# EAGLE design Main ESP32 (EAGLE 9.6.2)
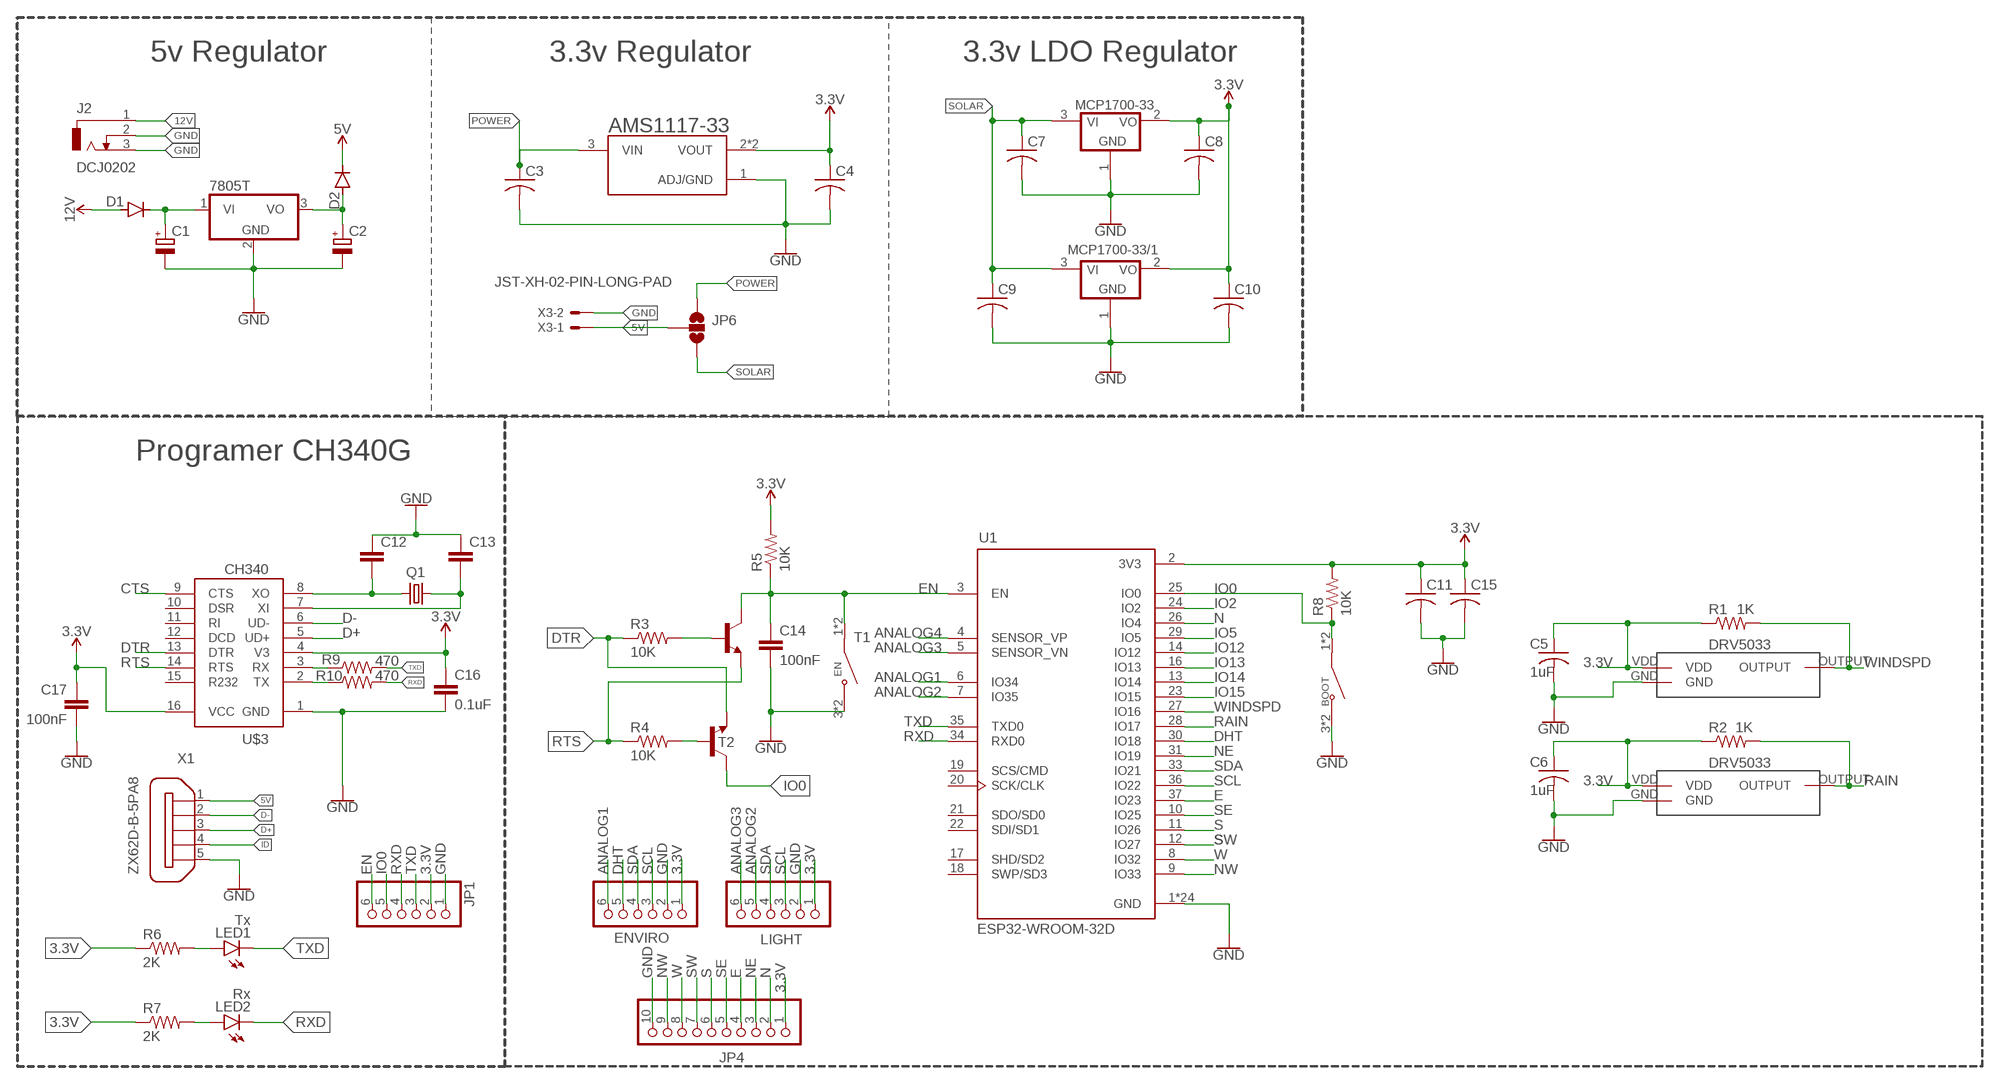
[diagram p0: schematic, sheet 1]

## Parts
AMS1117-33  AMS1117-5.0  [SOT229P700X180-4N]
BOOT  2-1437565-9  [SW_2-1437565-9]
C1  CPOL-EUE2.5-5  [E2,5-5]
C2  CPOL-EUE2.5-5  [E2,5-5]
C3  C-USC1206K  [C1206K]
C4  C-USC1206K  [C1206K]
C5  1uF  C-USC1206K  [C1206K]
C6  1uF  C-USC1206K  [C1206K]
C7  C-USC1206K  [C1206K]
C8  C-USC1206K  [C1206K]
C9  C-USC1206K  [C1206K]
C10  C-USC1206K  [C1206K]
C11  C-USC1206K  [C1206K]
C12  C-EUC1206K  [C1206K]
C13  C-EUC1206K  [C1206K]
C14  100nF  C-EUC1206K  [C1206K]
C15  C-USC1206K  [C1206K]
C16  0.1uF  C-EUC1206K  [C1206K]
C17  100nF  C-EUC1206K  [C1206K]
D1  1N4148DO35-10  [DO35-10]
D2  1N4148DO35-10  [DO35-10]
EN  2-1437565-9  [SW_2-1437565-9]
ENVIRO  PINHD-1X6/90  [1X06/90]
IC1  7805T  [TO220H]
J2  DCJ0202  [DCJ0202]
JP1  PINHD-1X6  [1X06]
JP4  PINHD-1X10/90  [1X10/90]
JP6  JUMPER-SMT_3_NO_SILK  [SMT-JUMPER_3_NO_SILK]
LED1  Tx  LEDCHIPLED_1206  [CHIPLED_1206]
LED2  Rx  LEDCHIPLED_1206  [CHIPLED_1206]
LIGHT  Light  PINHD-1X6/90  [1X06/90]
MCP1700-33  MCP1703-3302E/CB  [SOT23A_MICROCHIP_CB]
MCP1700-33/1  MCP1703-3302E/CB  [SOT23A_MICROCHIP_CB]
Q1  CRYSTALHC49S  [HC49/S]
R1  1K  R-US_R1206  [R1206]
R2  1K  R-US_R1206  [R1206]
R3  10K  R-US_R1206  [R1206]
R4  10K  R-US_R1206  [R1206]
R5  10K  R-US_R1206  [R1206]
R6  2K  R-US_R1206  [R1206]
R7  2K  R-US_R1206  [R1206]
R8  10K  R-US_R1206  [R1206]
R9  470  R-US_R1206  [R1206]
R10  470  R-US_R1206  [R1206]
T1  BC847  BC850  [SOT23]
T2  BC847  BC850  [SOT23]
U1  ESP32-WROOM-32D  [MODULE_ESP32-WROOM-32D]
U$1  DRV5033  [DRV5033]
U$2  DRV5033  [DRV5033]
U$3  CH340  [SOIC16]
X1  ZX62D-B-5PA8  [ZX62D-B-5PA8]
X3  JST-XH-02-PIN-LONG-PAD  [JST-XH-02-PACKAGE-LONG-PAD]

## Nets
3.3V: AMS1117-33.2(VOUT) AMS1117-33.4(VOUT) C4.1 C5.1 C6.1 C8.1 C10.1 C11.1 C15.1 C16.1 C17.1 ENVIRO.1 JP1.2 JP4.1 LIGHT.1 MCP1700-33.2(VO) MCP1700-33/1.2(VO) R1.1 R2.1 R5.2 R6.1 R7.1 R8.2 U1.2(3V3) U$1.VDD U$2.VDD U$3.4(V3) U$3.16(VCC)
5V: D2.C JP6.2 X1.1 X3.1
12V: D1.A J2.1
ANALOG1: ENVIRO.6 U1.6(IO34)
ANALOG2: LIGHT.5 U1.7(IO35)
ANALOG3: LIGHT.6 U1.5(SENSOR_VN)
ANALOG4: U1.4(SENSOR_VP)
CTS: U$3.9(CTS)
D+: U$3.5(UD+) X1.3
D-: U$3.6(UD-) X1.2
DHT: ENVIRO.5 U1.30(IO18)
DTR: R3.1 T2.2(E) U$3.13(DTR)
E: JP4.4 U1.37(IO23)
EN: C14.1 EN.1(COM) EN.2(COM) JP1.6 R5.1 T1.3(C) U1.3(EN)
GND: AMS1117-33.1(ADJ/GND) BOOT.3(NO) BOOT.4(NO) C1.- C2.- C3.2 C4.2 C5.2 C6.2 C7.2 C8.2 C9.2 C10.2 C11.2 C12.1 C13.1 C14.2 C15.2 C16.2 C17.2 EN.3(NO) EN.4(NO) ENVIRO.2 IC1.2(GND) J2.2 J2.3 JP1.1 JP4.10 LIGHT.2 MCP1700-33.1(GND) MCP1700-33/1.1(GND) U1.1(GND) U1.15(GND) U1.38(GND) U1.39_1(GND) U1.39_2(GND) U1.39_3(GND) U1.39_4(GND) U1.39_5(GND) U1.39_6(GND) U1.39_7(GND) U1.39_8(GND) U1.39_9(GND) U1.39_10(GND) U1.39_11(GND) U1.39_12(GND) U1.39_13(GND) U1.39_14(GND) U1.39_15(GND) U1.39_16(GND) U1.39_17(GND) U1.39_18(GND) U1.39_19(GND) U1.39_20(GND) U1.39_21(GND) U$1.GND U$2.GND U$3.1(GND) X1.5 X3.2
ID: X1.4
IO0: BOOT.1(COM) BOOT.2(COM) JP1.5 R8.1 T2.3(C) U1.25(IO0)
IO2: U1.24(IO2)
IO5: U1.29(IO5)
IO12: U1.14(IO12)
IO13: U1.16(IO13)
IO14: U1.13(IO14)
IO15: U1.23(IO15)
N: JP4.2 U1.26(IO4)
N$1: C1.+ D1.C IC1.1(VI)
N$2: C2.+ D2.A IC1.3(VO)
N$3: C12.2 Q1.2 U$3.8(XO)
N$4: C13.2 Q1.1 U$3.7(XI)
N$5: LED1.A R6.2
N$6: LED2.A R7.2
N$7: R9.1 U$3.3(RX)
N$8: R3.2 T1.1(B)
N$9: R10.1 U$3.2(TX)
N$10: R4.2 T2.1(B)
NE: JP4.3 U1.31(IO19)
NW: JP4.9 U1.9(IO33)
POWER: AMS1117-33.3(VIN) C3.1 JP6.1
RAIN: R2.2 U1.28(IO17) U$1.OUTPUT
RTS: R4.1 T1.2(E) U$3.14(RTS)
RXD: JP1.4 LED2.C R10.2 U1.34(RXD0)
S: JP4.6 U1.11(IO26)
SCL: ENVIRO.3 LIGHT.3 U1.36(IO22)
SDA: ENVIRO.4 LIGHT.4 U1.33(IO21)
SE: JP4.5 U1.10(IO25)
SOLAR: C7.1 C9.1 JP6.3 MCP1700-33.3(VI) MCP1700-33/1.3(VI)
SW: JP4.7 U1.12(IO27)
TXD: JP1.3 LED1.C R9.2 U1.35(TXD0)
W: JP4.8 U1.8(IO32)
WINDSPD: R1.2 U1.27(IO16) U$2.OUTPUT
Unconnected: U1.17(SHD/SD2) U1.18(SWP/SD3) U1.19(SCS/CMD) U1.20(SCK/CLK) U1.21(SDO/SD0) U1.22(SDI/SD1) U$3.10(DSR) U$3.11(RI) U$3.12(DCD) U$3.15(R232) X1.S1 X1.S2 X1.S3 X1.S4

## Notes on the sheet
- 5v Regulator | 3.3v Regulator | 3.3v LDO Regulator
- Programer CH340G

## Library data of the parts
AMS1117-33 = AMS1117-5.0:AMS1117-5.0: Sot223/Pkg 1-Amp 5-Volt Low Drop Out Voltage Regulatator Check prices <https://pricing.snapeda.com/parts/AMS1117-5.0/Advanced%20Monolithic%20Systems/view-part?ref=eda>; AVAILABILITY: No availability data; DESCRIPTION: Sot223/Pkg 1-Amp 5-Volt Low Drop Out Voltage Regulatator; MF: Advanced Monolithic Systems; MP: AMS1117-5.0; PACKAGE: None; PRICE: None
BOOT EN = 2-1437565-9:2-1437565-9: Check prices <https://pricing.snapeda.com/parts/2-1437565-9/TE%20Connectivity/view-part?ref=eda>; AVAILABILITY: In Stock; COMMENT: 2-1437565-9; DESCRIPTION: Tactile Switch SPST-NO Top Actuated Surface Mount; MF: TE Connectivity; MP: 2-1437565-9; PACKAGE: SMD-6 Omron Electronics; PRICE: None
C1 C2 = rcl:CPOL-EU: POLARIZED CAPACITOR, European symbol; SPICEPREFIX: C
C3-C11 C15 = rcl:C-US: CAPACITOR, American symbol; SPICEPREFIX: C
C12-C14 C16 C17 = rcl:C-EU: CAPACITOR, European symbol; SPICEPREFIX: C
D1 D2 = diode:1N4148: DIODE high speed (Philips)
ENVIRO JP1 LIGHT = pinhead:PINHD-1X6: PIN HEADER
IC1 = linear:78*: Positive VOLTAGE REGULATOR Source: http://cache.national.com/ds/LM/LM78L05.pdf http://www.fairchildsemi.com/ds/LM/LM7805.pdf
J2 = con-jack:DCJ0202: DC POWER JACK Source: DCJ0202.pdf; OC_FARNELL: unknown; OC_NEWARK: unknown
JP4 = pinhead:PINHD-1X10: PIN HEADER
JP6 = SparkFun-Jumpers:JUMPER-SMT_3_NO: Normally open jumper This jumper has three pads in close proximity to each other. Apply solder to close the connection(s).
LED1 LED2 = led:LED: LED OSRAM: - CHIPLED LG R971, LG N971, LY N971, LG Q971, LY Q971, LO R971, LY R971 LH N974, LH R974 LS Q976, LO Q976, LY Q976 LO Q996 - Hyper CHIPLED LW Q18S LB Q993, LB Q99A, LB R99A - SideLED LS A670, LO A670, LY A670, LG A670, LP A670 LB A673, LV A673, LT A673, LW A673 LH A674 LY A675 LS A676, LA A676, LO A676, LY A676, LW A676 LS A679, LY A679, LG A679 - Hyper Micro SIDELED® LS Y876, LA Y876, LO Y876, LY Y876 LT Y87S - SmartLED LW L88C, LW L88S LB L89C, LB L89S, LG L890 LS L89K, LO L89K, LY L89K LS L896, LA L896, LO L896, LY L896 - TOPLED LS T670, LO T670, LY T670, LG T670, LP T670 LSG T670, LSP T670, LSY T670, LOP T670, LYG T670 LG T671, LOG T671, LSG T671 LB T673, LV T673, LT T673, LW T673 LH T674 LS T676, LA T676, LO T676, LY T676, LB T676, LH T676, LSB T676, LW T676 LB T67C, LV T67C, LT T67C, LS T67K, LO T67K, LY T67K, LW E67C LS E67B, LA E67B, LO E67B, LY E67B, LB E67C, LV E67C, LT E67C LW T67C LS T679, LY T679, LG T679 LS T770, LO T770, LY T770, LG T770, LP T770 LB T773, LV T773, LT T773, LW T773 LH T774 LS E675, LA E675, LY E675, LS T675 LS T776, LA T776, LO T776, LY T776, LB T776 LHGB T686 LT T68C, LB T68C - Hyper Mini TOPLED® LB M676 - Mini TOPLED Santana® LG M470 LS M47K, LO M47K, LY M47K Source: http://www.osram.convergy.de LUXEON: - LUMILED® LXK2-PW12-R00, LXK2-PW12-S00, LXK2-PW14-U00, LXK2-PW14-V00 LXK2-PM12-R00, LXK2-PM12-S00, LXK2-PM14-U00 LXK2-PE12-Q00, LXK2-PE12-R00, LXK2-PE12-S00, LXK2-PE14-T00, LXK2-PE14-U00 LXK2-PB12-K00, LXK2-PB12-L00, LXK2-PB12-M00, LXK2-PB14-N00, LXK2-PB14-P00, LXK2-PB14-Q00 LXK2-PR12-L00, LXK2-PR12-M00, LXK2-PR14-Q00, LXK2-PR14-R00 LXK2-PD12-Q00, LXK2-PD12-R00, LXK2-PD12-S00 LXK2-PH12-R00, LXK2-PH12-S00 LXK2-PL12-P00, LXK2-PL12-Q00, LXK2-PL12-R00 Source: www.luxeon.com KINGBRIGHT: KA-3528ASYC Source: www.kingbright.com
MCP1700-33 MCP1700-33/1 = MCP1700:MCP1703*02E/CB: MCP1703[A] Series of Voltage Regulators – SOT23A (Microchip CB) (1.2 … 5.0)V, LDO, 16 V Input, 100/150/200/250 mA, Low Quiescent Current Source: http://ww1.microchip.com/downloads/en/DeviceDoc/22049f.pdf http://ww1.microchip.com/downloads/en/DeviceDoc/25122A.pdf Packages: SOT23, Microchip package identifier "CB" (dimensions and recommended land patterns acc. to Microchip) Technologies: MCP1703[A]T-xx02E/CB T : Tape and Reel xx: Output Voltage * 1000 mV; 12|15|18|25|28|30|33|40|50 0 : Extra Feature Code (fixed) 2 : Output volt. Tol.: ±2% (standard) E : Temperature range (−40…+125)°C CB: Package: SOT23A Author: Dipl.-Ing. FH Rainer Bayer HHN Hochschule Heilbronn, rainer.bayer@hs-heilbronn.de Ingenieurbüro ing-rb, mail@ing-rb.de
Q1 = adafruit:CRYSTAL: CRYSTAL; OC_FARNELL: 1667008; OC_NEWARK: unknown
R1-R10 = rcl:R-US_: RESISTOR, American symbol; SPICEPREFIX: R
T1 T2 = transistor:BC850: NPN TRANSISTOR
U1 = ESP32-WROOM-32D:ESP32-WROOM-32D: Bluetooth, WiFi 802.11b/g/n, Bluetooth v4.2 + EDR, Class 1, 2 and 3 Transceiver Module 2.4GHz ~ 2.5GHz Integrated, Trace Surface Mount Check prices <https://pricing.snapeda.com/parts/ESP32-WROOM-32D/Espressif%20Systems/view-part?ref=eda>; AVAILABILITY: In Stock; DESCRIPTION: Bluetooth, WiFi 802.11b/g/n, Bluetooth v4.2 +EDR, Class 1, 2 and 3 Transceiver Module 2.4GHz ~ 2.5GHz Integrated; MF: Espressif Systems; MP: ESP32-WROOM-32D; PACKAGE: Module Espressif Systems; PRICE: None; PURCHASE-URL: https://pricing.snapeda.com/search/part/ESP32-WROOM-32D/?ref=eda
U$1 U$2 = DRV5033 hall Sensor :DRV5033
U$3 = CH340:CH340: Check prices <https://pricing.snapeda.com/parts/CH340/DFRobot/view-part?ref=eda>; AVAILABILITY: In Stock; DESCRIPTION: CH340G USB 2.0 to UART (RS232/RS422/RS485) Bridge Interface Evaluation Board; MF: DFRobot; MP: CH340; PACKAGE: None; PRICE: None; PURCHASE-URL: https://pricing.snapeda.com/search/part/CH340/?ref=eda
X1 = zx62d-b-5pa8-oshpark_10:ZX62D-B-5PA8: Micro USB Type B Connector - Standard, Shell Through Hole Source: http://www.hirose.co.jp/cataloge_hp/ed_ZX_20140804.pdf; MF: Hirose; MPN: ZX62D-B-5PA8; OC_FARNELL: 2300438; OC_NEWARK: 69W0712
X3 = Rembrandt Electronics - JST XH Connectors v1-0:JST-XH-02-PIN: JST XH Connector 2 Pin Wire to board connector. Pitch: 2,54 mm, (0.100") Number of pins: 2 Created by Rembrandt Electronics www.rembrandtelectronics.com

## Board
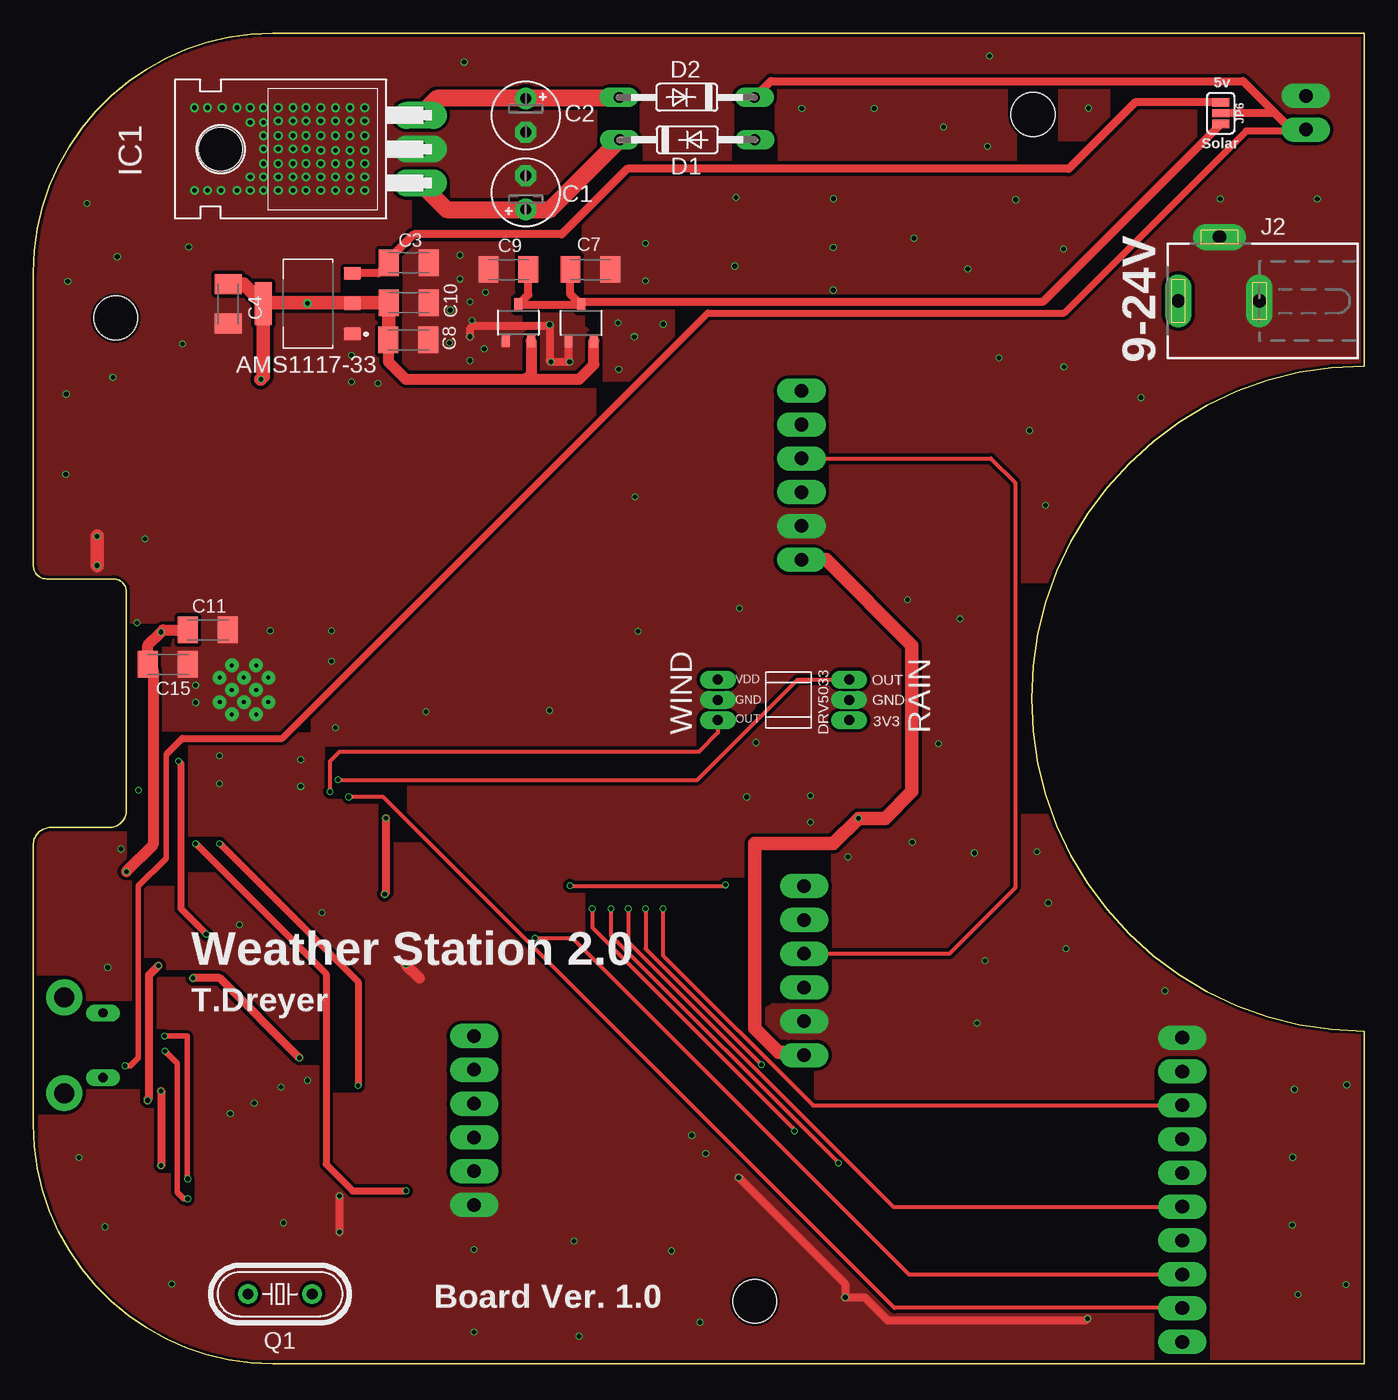
[diagram p1: board, top side]
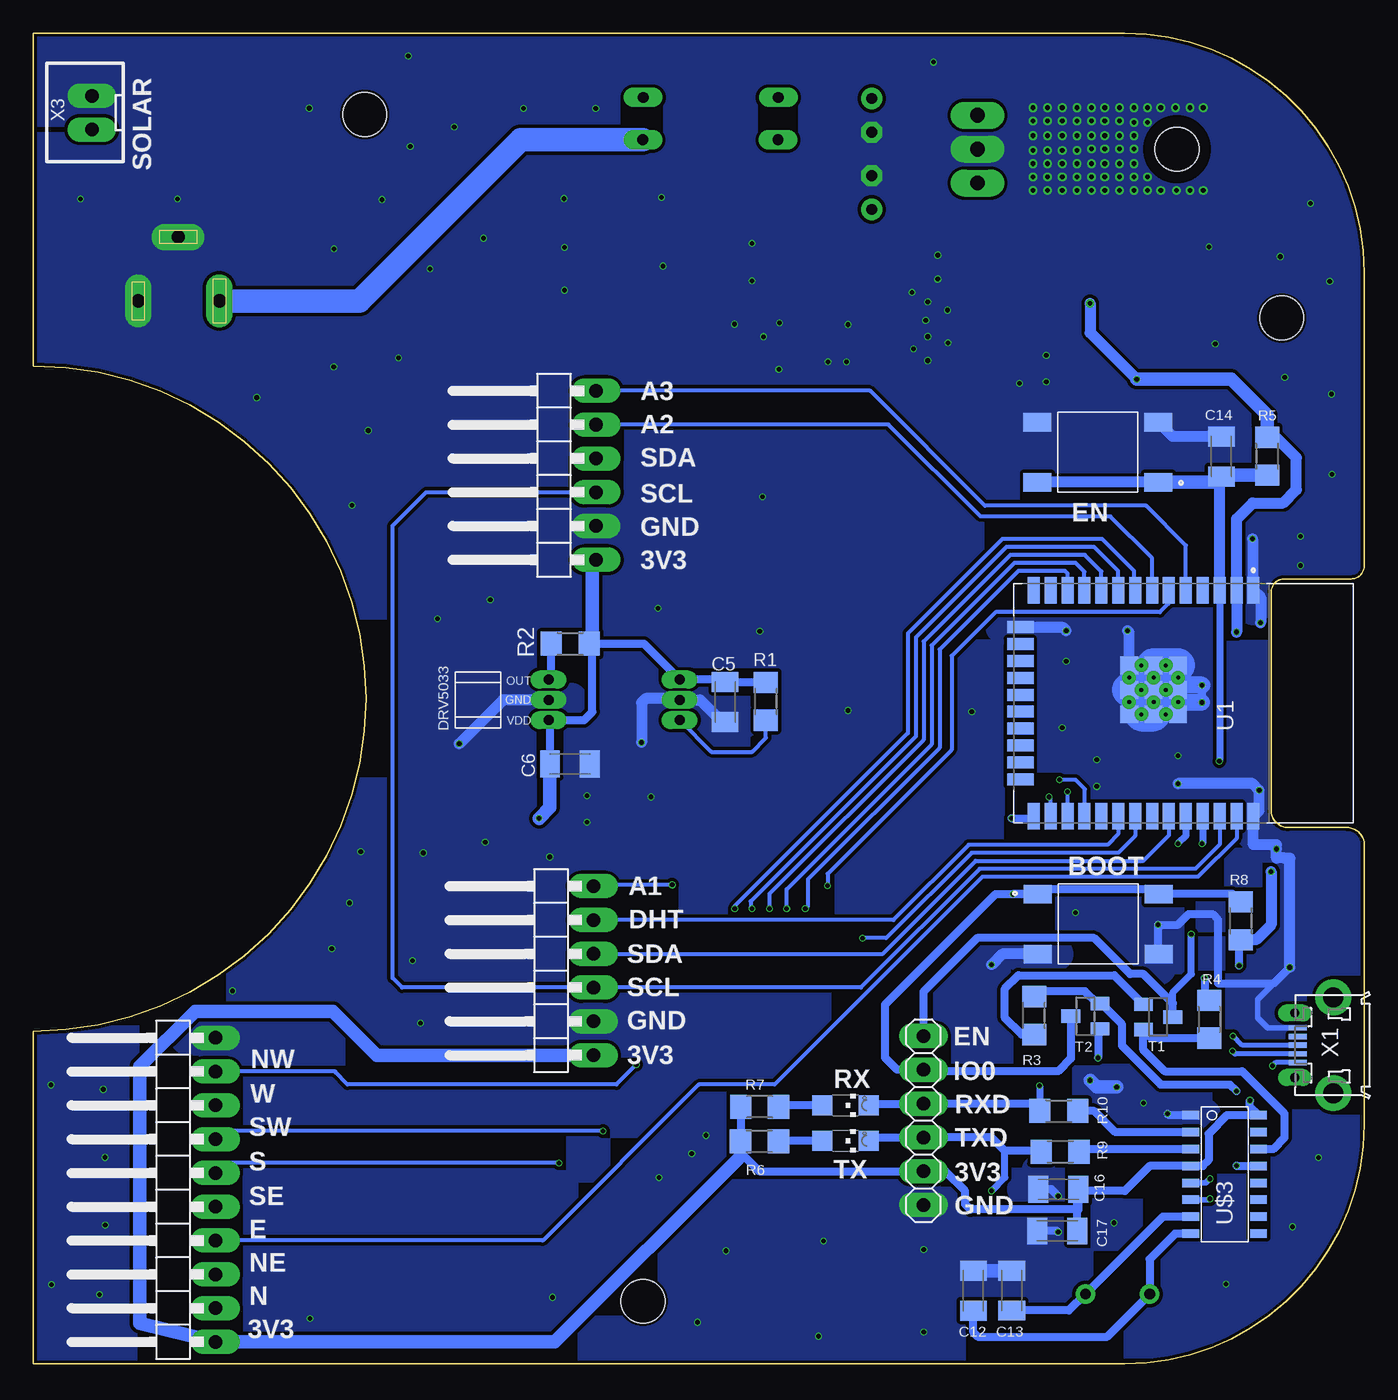
[diagram p2: board, bottom side, seen from below]

Size 100 x 100 mm. Coordinates in mm from the lower left corner, seen from the top.
Outline: 0,18 0,39 arc-90 1.3,40.3 5.7,40.3 arc90 7,41.6 7,58 arc90 6,59 1,59 arc-90 0,60 0,82 arc-90 18,100 100,100 100,75 arc180 100,25 100,0 18,0 arc-90 0,18
Copper layers (1*16): Top 0.035mm / dielectric 1.6mm / Bottom 0.035mm
Design rules "jlcpcb-2layers *": minimum track width 5mil, minimum drill 0.3mm, track to track 10mil, track to pad 5mil, pad to pad 5mil, via to via 5mil, smd to smd 5mil, copper to edge 0.2mm, drill to drill 6mil, minimum pad ring 10mil, minimum via ring 3mil, stop-mask expansion 4mil, vias tented up to drill 16mil, thermal gap 10mil
Holes 3.3 mm at 54.2,4.7 75.1,93.9 6.2,78.6

### Footprints (pad centres in the part's own frame; a part is rotated, then mirrored left to right if it is on the bottom)
SOT229P700X180-4N = smd 0.93 x 1.31: 1 -2.29,-3.345; 2 0,-3.345; 3 2.29,-3.345 | smd 3.24 x 1.31: 4 0,3.345
SW_2-1437565-9 = smd 2.1 x 1.4: 1 -4.55,2.25; 2 4.55,2.25; 3 -4.55,-2.25; 4 4.55,-2.25
E2,5-5 = drill 0.813 pad 1.6: + -1.27,0 | drill 0.813 pad 1.6 octagon: - 1.27,0
C1206K = smd 1.5 x 2: 1 -1.5,0; 2 1.5,0
DO35-10 = drill 0.813 long: A 5.08,0; C -5.08,0
1X06/90 = drill 1.016 long: 1 -6.35,-3.81; 2 -3.81,-3.81; 3 -1.27,-3.81; 4 1.27,-3.81; 5 3.81,-3.81; 6 6.35,-3.81
TO220H = drill 1.118 long: 1 -2.54,-10.16; 2 0,-10.16; 3 2.54,-10.16 | hole 3.302: 0,4.826
DCJ0202 = drill 1 pad 2 long: 1 0,3.1; 2 4.8,0; 3 0,-3
1X06 = drill 1.016 long: 1 -6.35,0; 2 -3.81,0; 3 -1.27,0; 4 1.27,0; 5 3.81,0; 6 6.35,0
1X10/90 = drill 1.016 long: 1 -11.43,-3.81; 2 -8.89,-3.81; 3 -6.35,-3.81; 4 -3.81,-3.81; 5 -1.27,-3.81; 6 1.27,-3.81; 7 3.81,-3.81; 8 6.35,-3.81; 9 8.89,-3.81; 10 11.43,-3.81
SMT-JUMPER_3_NO_SILK = smd 0.635 x 1.27: 1 -0.813,0; 2 0,0; 3 0.813,0
CHIPLED_1206 = smd 1.5 x 1.5: A 0,-1.75; C 0,1.75
SOT23A_MICROCHIP_CB = smd 0.6 x 1: 1 -0.95,-1.35; 2 0.95,-1.35; 3 0,1.35
HC49/S = drill 0.813: 1 -2.413,0; 2 2.413,0
R1206 = smd 1.6 x 1.803: 1 -1.422,0; 2 1.422,0
SOT23 = smd 1 x 1.4: 1 -0.95,-1.1; 2 0.95,-1.1; 3 0,1.1
MODULE_ESP32-WROOM-32D = smd 2 x 0.9: 1 -8.5,5.26; 2 -8.5,3.99; 3 -8.5,2.72; 4 -8.5,1.45; 5 -8.5,0.18; 6 -8.5,-1.09; 7 -8.5,-2.36; 8 -8.5,-3.63; 9 -8.5,-4.9; 10 -8.5,-6.17; 11 -8.5,-7.44; 12 -8.5,-8.71; 13 -8.5,-9.98; 14 -8.5,-11.25; 25 8.5,-11.25; 26 8.5,-9.98; 27 8.5,-8.71; 28 8.5,-7.44; 29 8.5,-6.17; 30 8.5,-4.9; 31 8.5,-3.63; 32 8.5,-2.36; 33 8.5,-1.09; 34 8.5,0.18; 35 8.5,1.45; 36 8.5,2.72; 37 8.5,3.99; 38 8.5,5.26 | smd 0.9 x 2: 15 -5.715,-12.25; 16 -4.445,-12.25; 17 -3.175,-12.25; 18 -1.905,-12.25; 19 -0.635,-12.25; 20 0.635,-12.25; 21 1.905,-12.25; 22 3.175,-12.25; 23 4.445,-12.25; 24 5.715,-12.25 | smd 1.33 x 1.33: 39_1 -2.835,-0.405; 39_2 -1,-0.405; 39_3 0.835,-0.405; 39_4 -2.835,-2.24; 39_5 -1,-2.24; 39_6 0.835,-2.24; 39_7 -2.835,-4.075; 39_8 -1,-4.075; 39_9 0.835,-4.075 | drill 0.3 pad 1.016: 39_10 -1.917,-0.405; 39_11 -0.083,-0.405; 39_12 -2.835,-1.323; 39_13 -1,-1.323; 39_14 0.835,-1.323; 39_15 -1.917,-2.24; 39_16 -0.083,-2.24; 39_17 -2.835,-3.158; 39_18 -1,-3.158; 39_19 0.835,-3.158; 39_20 -1.917,-4.075; 39_21 -0.083,-4.075
DRV5033 = drill 0.75 pad 1.016 long: GND 0,0; OUTPUT 1.524,0; VDD -1.524,0
SOIC16 = smd 1.27 x 0.635: 1 -2.54,3.81; 2 -2.54,2.54; 3 -2.54,1.27; 4 -2.54,0; 5 -2.54,-1.27; 6 -2.54,-2.54; 7 -2.54,-3.81; 8 -2.54,-5.08; 9 2.54,-5.08; 10 2.54,-3.81; 11 2.54,-2.54; 12 2.54,-1.27; 13 2.54,0; 14 2.54,1.27; 15 2.54,2.54; 16 2.54,3.81
ZX62D-B-5PA8 = smd 1.35 x 0.4: 1 4.825,1.3; 2 4.825,0.65; 3 4.825,0; 4 4.825,-0.65; 5 4.825,-1.3 | drill 1.5: S1 2.15,-3.6; S2 2.15,3.6 | drill 0.7 long: S3 5.05,2.425; S4 5.05,-2.425
JST-XH-02-PACKAGE-LONG-PAD = drill 1.016 long: 1 -1.27,0; 2 1.27,0

### Placement (x,y rotation side)
AMS1117-33  20.63,79.68 90 top
BOOT  19.99,33.05 0 bottom
C1  37,88.03 90 top
C2  37,93.83 270 top
C3  28.22,82.75 0 top
C4  14.65,79.66 270 top
C5  48.02,49.74 270 bottom
C6  59.68,45.08 0 bottom
C7  41.86,82.25 0 top
C8  28.18,76.95 0 top
C9  35.7,82.25 180 top
C10  28.22,79.75 0 top
C11  13.12,55.16 0 top
C12  29.37,5.49 270 bottom
C13  26.49,5.51 270 bottom
C14  10.74,68.2 90 bottom
C15  10.11,52.56 0 top
C16  22.98,13.12 180 bottom
C17  23.07,9.99 180 bottom
D1  49.13,92 0 top
D2  49.1,95.18 180 top
EN  20.02,68.51 180 bottom
ENVIRO  61.73,29.55 90 bottom
IC1  18.9,91.29 90 top
J2  89.11,79.88 90 top
JP1  33.13,18.29 90 bottom
JP4  90.13,13.08 90 bottom
JP6  89.2,93.99 270 top
LED1  38.98,16.76 270 bottom
LED2  38.98,19.43 270 bottom
LIGHT  61.52,66.78 90 bottom
MCP1700-33  36.45,78.25 0 top
MCP1700-33/1  41.16,78.24 0 top
Q1  18.54,5.24 180 top
R1  44.96,49.78 270 bottom
R2  59.66,54.12 180 bottom
R3  24.82,26.17 270 bottom
R4  11.64,25.9 90 bottom
R5  7.31,68.22 90 bottom
R6  45.44,16.71 0 bottom
R7  45.43,19.32 0 bottom
R8  9.27,33.29 270 bottom
R9  22.86,15.94 180 bottom
R10  22.96,19 180 bottom
T1  15.49,26.07 270 bottom
T2  20.95,26.12 90 bottom
U1  13.59,49.65 270 bottom
U$1  61.29,49.9 90 bottom
U$2  51.44,49.9 270 top
U$3  10.49,14.87 0 bottom
X1  0.18,23.95 180 bottom
X3  95.6,94.03 90 bottom

### Tracks (layer width: path | path; a pad name or v marks a point on that pad's centre or on a via)
3.3V  (via drill 0.35, 0.35 pad 0.65)
  Top 0.61: AMS1117-33.2 24.05,79.75 | 26.72,76.99 C8.1 | v9.4,29.92 8.69,29.2 8.69,19.99 8.6,19.9 v8.6,19.8
  Top 0.813: C8.1 26.68,75.32 28,74 37,74 | MCP1700-33/1.2 42.11,75.11 41,74 37,74 | MCP1700-33.2 37.4,74.39 37,74 | C11.1 9.76,55.16 v9.6,55 8.61,54.01 C15.1 9.01,52.16 9.01,39.01 v7,37
  Top 1: C4.1 15.8,81.16 AMS1117-33.4 | 24.05,79.75 C10.1
  Top 1.016: C10.1 26.72,76.99 | v17.1,74 17.29,74.19 AMS1117-33.4 17.36,79.75 24.05,79.75 | ENVIRO.1 57.72,23.4 56,23.4 54.2,25.2 54.2,39.1 60.1,39.1 v62,41 64,41 66,43 66,54 59.57,60.43 LIGHT.1
  Bottom 0.61: R1.1 47.98,51.21 C5.1 48.2,51.42 U$2.VDD 54.14,54.12 R2.1 58,53.88 58,49 58.62,48.38 U$1.VDD 61.18,48.27 C6.1 | 21.48,13 C16.1 21.36,13 18,13 16.13,14.87 U$3.4 12.13,14.87 11.7,15.3 11.7,17.3 10.32,18.68 U$3.16 8.6,19.33 v8.6,19.8 | 21.48,13 21.48,11.6 29.6,11.6 30,12 30,13 31.48,14.48 JP1.2 45.48,14.48 46.86,15.86 R6.1 46.85,16.73 R7.1 | C17.1 21.57,12.91 21.48,13 | v9.4,29.92 9.4,31.74 R8.2
  Bottom 0.813: R5.2 6.64,69.64 5.1,68.1 5.1,65.7 6.1,64.7 8.4,64.7 9.6,63.5 U1.2 v9.6,55 | v7,37 7,33 8.13,31.87 R8.2 | v20.6,79.7 20.6,77.5 v17.1,74
  Bottom 1.016: v17.1,74 17.09,74.01 10.01,74.01 7.31,71.31 R5.2 | v62,41 61.18,41.82 C6.1 | LIGHT.1 58,60.14 58,53.88 | R6.1 46.86,15.61 60.84,1.64 60.84,1.65 JP4.1 92,3.04 92,22.34 87.83,26.51 77.51,26.51 74.2,23.2 ENVIRO.1
5V  (via drill 0.35)
  Top 0.406: v6.9,22.4 7.3,22.4 7.9,23 7.9,35.9 10,38 10,45.8 10.1,45.9
  Top 0.508: 10.1,45.9 11.2,47 18.7,47 50.68,78.98 77.45,78.98 91.12,92.65 95.5,92.65 X3.1
  Top 0.61: D2.C 55.41,96.41 90.89,96.41 94.54,92.76 X3.1 94.51,92.76 93.28,93.99 JP6.2
  Bottom 0.39: X1.1 6.65,22.65 v6.9,22.4
12V
  Bottom 1.778: D1.A 63.39,92 75.5,79.88 J2.1
ANALOG1  (via drill 0.35)
  Top 0.305: v40.33,35.92 51.92,35.92 v52,36
  Bottom 0.305: U1.6 14.72,58.11 14.72,57.13 15.36,56.5 27.7,56.5 31,53.2 31,46.15 40.33,36.83 v40.33,35.92 | v52,36 57.82,36 ENVIRO.6
ANALOG2
  Bottom 0.305: U1.7 15.95,60.55 19.09,63.69 28.84,63.69 35.75,70.6 57.7,70.6
  Bottom 0.61: 57.7,70.6 LIGHT.5
ANALOG3
  Bottom 0.305: U1.5 13.41,61.51 16.4,64.5 28.5,64.5 37.13,73.13 LIGHT.6
D+  (via drill 0.35)
  Top 0.406: v9.86,24.64 11.56,24.64 11.56,13.94 v11.6,13.9
  Bottom 0.39: X1.3 9.16,23.95 v9.86,24.64
  Bottom 0.406: v11.6,13.9 11.9,13.6 U$3.5
D-  (via drill 0.35)
  Top 0.406: v9.9,23.5 10.8,22.6 10.8,12.9 11.3,12.4 v11.6,12.4
  Bottom 0.39: X1.2 9.7,23.3
  Bottom 0.406: v11.6,12.4 11.67,12.33 U$3.6 | 9.7,23.3 v9.9,23.5
DHT
  Bottom 0.305: U1.30 18.49,39.81 19.28,39.02 29.72,39.02 35.38,33.36 ENVIRO.5
DTR  (via drill 0.35)
  Top 0.61: v9.6,20.5 v9.6,14.9
  Bottom 0.61: R3.1 24.41,28 21,28 20.07,27.07 T2.2 19.77,27.07 18.2,25.5 18.2,23.9 15.3,21 10.1,21 v9.6,20.5 | v9.6,14.9 9.57,14.87 U$3.13
E
  Bottom 0.305: U1.37 9.6,39.5 12.5,36.6 28.7,36.6 44.3,21 50,21 61.74,9.26 61.74,9.27 JP4.4
EN  (via drill 0.35)
  Top 0.508: v13,32.3 11.1,34.2 11.1,45.1 v10.9,45.3
  Bottom 0.508: U1.3 10.87,45.33 v10.9,45.3 | T1.3 14.39,27.91 13,29.3 v13,32.3
  Bottom 0.61: T1.3 14.39,27.09 16.6,29.3 17.6,29.3 20.3,32 29.1,32 33.13,27.97 JP1.6
  Bottom 0.813: U1.3 10.87,66.58 C14.1 | EN.1 EN.2
  Bottom 1.016: R5.1 10.65,66.8 C14.1 11.19,66.26 EN.1
GND  (via drill 0.35, 0.35 pad 0.65)
  Top 0.61: v23,12.6 v23,9.9 | v53,14 61,6 v61,5 62.47,5 64.23,3.24 79.04,3.24 v79.2,3.4 | MCP1700-33/1.1 40.21,75.39 v40.3,75.3 v38.9,75.3 38.8,75.4 v38.8,78.1 38.7,78 33,78 32.8,77.8 v32.8,77.2
  Top 0.813: v28,30 29,29
  Top 1.016: v4.8,62.2 v4.8,60
  Bottom 0.406: X1.5 7.25,25.25 8,26 8,27.4 v5.6,29.8
  Bottom 0.61: BOOT.4 15.5,30.86 v15.5,33 14,33 13.2,33.8 11.4,33.8 11,33.4 11,28.6 6.8,28.6 v5.6,29.8 | U$3.1 14.68,18.68 v14.8,18.8 | v23,9.9 23.09,9.99 C17.2 | v23,12.6 23.52,13.12 C16.2 | U1.39_21 U1.39_9 | U1.39_16 U1.39_6 15,48.81 | 13.99,52 U1.39_2 13.64,51 | 12.23,49.73 v12.2,49.7 v12.2,51 | U1.39_12 U1.39_4
  Bottom 0.813: U1.15 22.66,55.37 v22.4,55.1 | U1.39_7 17.66,54.97 v17.8,55.1 | U1.39_2 U1.39_3 15,48.81 | U1.39_6 U1.39_5 | U1.39_8 U1.39_9 U1.39_6 | U1.39_7 U1.39_4 | U1.39_7 U1.39_8 | v7.8,55.7 7.8,57.62 U1.1 8.4,58.22 v8.4,62 | v14,43.6 8.4,43.6 v7.9,43.1 7.9,41.58 U1.38 8.33,39 6.6,39 v6.6,38.7 6.6,38.02 5.98,38.02 5.98,38 5.6,38 v5.6,29.8 | C5.2 48.24,48.24 49.9,49.9 U$2.GND 51.54,50 54,50 54.3,49.7 v54.3,46.7 | U$1.GND 64.7,49.9 v68,46.6 | C14.2 14.41,69.7 EN.3 | U1.39_17 U1.39_7 | U1.39_20 U1.39_8 | U1.39_18 U1.39_8 | U1.39_14 U1.39_6 | BOOT.3 27.2,30.8 v28,30
  Bottom 1.016: C13.1 29.35,7.01 C12.1 | v20.6,21.3 20.1,20.8 v18.6,20.8 | 13.99,52 U1.39_1 U1.39_10
  Bottom 1.27: U1.39_11 12.23,49.73 | v12.2,51 13.64,51
  Bottom 2.54: U1.39_1 U1.39_4 U1.39_15 U1.39_13 | U1.39_8 U1.39_5 | U1.39_19 U1.39_6
  other vias: 22.4,52.8 22.7,47.8 20.1,45.4 20.1,43.4 14,45.7 85.03,28.03 71.5,30.3 61.2,38.1 70.7,38.4 75.4,38.5 70.9,25.6 33.1,2.4 33.1,8.6 18.8,10.6 10.4,6 5.4,10.3 16.6,19.6 23.9,75.8 23.9,73.8 25.9,73.7 32.8,75.4 32.8,79.8 46,84.2 46,81.4 52.7,82.5 60.1,83.9 60.1,80.7 70.2,82.3 77.4,83.8 73.81,87.5 89.17,87.54 53.6,42.6 58.4,42.7 58.4,40.7 29.5,49 24.9,94.4 24.9,93.4 24.9,92.3 24.9,91.2 24.9,90.2 24.9,89.2 24.9,88.2 23.8,88.2 22.7,88.2 21.6,88.2 20.5,88.2 19.5,88.2 18.4,88.2 17.3,88.2 16.3,88.2 15.3,88.2 14.1,88.2 23.8,89.2 23.8,90.2 23.8,91.2 23.8,92.3 23.8,93.4 23.8,94.4 22.7,94.4 22.7,93.4 22.7,92.3 22.7,91.2 22.7,90.2 22.7,89.2 21.6,89.2 21.6,90.2 21.6,91.2 21.6,92.3 21.6,93.4 21.6,94.4 20.5,94.4 20.5,93.4 20.5,92.3 20.5,91.3 20.5,90.2 20.5,89.2 19.5,89.2 19.5,90.2 19.5,91.3 19.5,92.3 19.5,93.4 19.5,94.4 18.4,94.4 18.4,93.4 18.4,92.3 18.4,91.3 18.4,90.2 18.4,89.2 17.3,89.2 17.3,90.2 17.3,91.3 17.3,92.3 17.3,93.3 17.3,94.4 16.3,94.4 15.3,94.4 14.2,94.4 13.1,94.4 12.1,94.4 13.1,88.2 12.1,88.2 16.3,93.3 16.3,89.2 57.74,94.34 63.18,94.34 68.38,92.97 79.27,94.37 52.79,87.67 60.13,87.57 66.17,84.6 45.15,77.19 98.67,20.96 98.63,5.97 32.05,81.53 32.05,83.33 32.95,78.43 33.88,76.28 31.28,76.74 31.32,79.19 33.97,80.53 43.93,78.23 43.99,74.74 47.33,78.14 2.44,66.86 2.47,72.88 2.59,81.35 4.04,87.21 11.68,83.95 6.31,83.21 11.2,76.65 5.98,74.13 72.56,75.61 74.83,70.14 76.05,64.51 83.21,72.62 77.42,74.94 96.46,87.56 32.37,97.83 71.83,98.3 71.68,91.5 45.21,65.16 38.79,49.11 53.05,56.79 45.42,55.05 77.58,31.22 76.25,34.64 66.04,39.22 69.62,56 65.67,57.43 40.63,9.22 47.95,8.49 50.1,3.13 41,2.08 50.53,15.81 94.74,20.63 94.59,10.43 95.02,5.2 94.62,15.52 3.43,15.51 49.47,17.17 21.7,33.9
  pour Top: -13,104 -13,-7 118,-7 118,104
  pour Bottom: -20,109 -20,-12 122,-12 122,109
IO0  (via drill 0.35)
  Top 0.61: v26.4,35.3 26.5,35.4 v26.5,41
  Bottom 0.61: T2.3 22.05,22.95 23,22 33.03,22 JP1.5 35.1,22.1 36,23 36,27 27.7,35.3 BOOT.1 | BOOT.1 24.14,35.7 15.84,35.7 BOOT.2 9.86,35.3 R8.1 | BOOT.1 v26.4,35.3 | v26.5,41 24.99,41 U1.25
N  (via drill 0.35)
  Top 0.305: v23.7,42.6 26.3,42.6 64.7,4.2 JP4.2
  Bottom 0.305: U1.26 23.57,42.6 v23.7,42.6
N$1
  Top 1.27: IC1.1 31.05,86.76 C1.+ 38.81,86.76 D1.C
N$2
  Top 1.27: D2.A 43.94,95.1 C2.+ 30.33,95.1 IC1.3
N$3
  Bottom 0.61: C12.2 29.37,2.37 29,2 19.37,2 Q1.2 16.13,7.87 14.21,9.79 U$3.8
N$4
  Bottom 0.61: C13.2 22.19,4.01 Q1.1 15.14,11.06 U$3.7
N$5
  Bottom 0.61: LED1.A 43.97,16.76 R6.2
N$6
  Bottom 0.61: LED2.A 43.9,19.43 R7.2
N$7
  Bottom 0.61: U$3.3 21.24,16.14 R9.1
N$8
  Bottom 0.61: R3.2 25.75,24.75 27,26 27,28.2 26,29.2 18.78,29.2 T1.1
N$9
  Bottom 0.61: U$3.2 18.71,17.41 20.3,19 R10.1
N$10  (via drill 0.35)
  Top 0.61: v20,23 14,29 v12,29
  Bottom 0.61: T2.1 20,25.03 v20,23 | v12,29 12,27.68 R4.2
NE  (via drill 0.35)
  Top 0.305: v37.7,32 40.5,32 65.77,6.73 JP4.3
  Bottom 0.305: U1.31 17.22,39.68 18.49,38.41 29.51,38.41 35.92,32 v37.7,32
NW  (via drill 0.35)
  Top 0.305: v46,34.2 46,31.2 v54.7,22.5
  Bottom 0.305: U1.9 18.49,59.59 20.3,61.4 26.9,61.4 33.7,54.6 33.7,47.17 46.1,34.77 46.1,34.3 v46,34.2 | v54.7,22.5 56.2,21 76.4,21 77.29,21.89 77.3,21.97 JP4.9
POWER
  Top 0.61: JP6.1 82.77,94.8 77.78,89.81 44.61,89.81 39.7,84.9 28.6,84.9 26.72,83.02 C3.1 25.94,81.97 AMS1117-33.3
RAIN  (via drill 0.35)
  Top 0.305: v22.9,43.9 49.9,43.9 57.42,51.42 U$1.OUTPUT
  Bottom 0.305: U1.28 21,41.18 21,43.2 21.7,43.9 v22.9,43.9
  Bottom 0.61: U$1.OUTPUT 61.08,51.63 R2.2
RTS
  Bottom 0.61: R4.1 15.95,24.48 T1.2 16.59,23.59 15,22 9.19,22 6,18.82 6,17 6.86,16.14 U$3.14
RXD  (via drill 0.35)
  Top 0.508: v14,39.1 24.4,28.7 v24.4,20.9
  Bottom 0.508: U1.34 13.41,39.69 v14,39.1 | v24.4,20.9 24.4,19.02 R10.2
  Bottom 0.61: R10.2 24.94,19.56 JP1.4 37.1,19.56 LED2.C
S  (via drill 0.35)
  Top 0.305: v43.4,34.2 43.4,32.2 v60.5,15.1
  Bottom 0.305: U1.11 21.03,59.53 21.7,60.2 26.3,60.2 32.5,54 32.5,46.57 43.4,35.67 v43.4,34.2 | v60.5,15.1 86.24,15.1 JP4.6
SCL
  Bottom 0.305: U1.36 10.87,39.03 12.7,37.2 28.9,37.2 37.82,28.28 ENVIRO.3 72.28,28.28 73,29 73,63 70.49,65.51 LIGHT.3
SDA
  Top 0.305: LIGHT.4 71.95,68.05 73.77,66.23 73.77,35.77 68.82,30.82 ENVIRO.4
  Bottom 0.305: U1.33 14.68,39.72 16.6,37.8 29.2,37.8 36.18,30.82 ENVIRO.4
SE  (via drill 0.35)
  Top 0.305: v44.7,34.2 44.7,31.7 64.6,11.8 64.6,11.81 JP4.5
  Bottom 0.305: U1.10 19.76,59.56 21,60.8 26.6,60.8 33.11,54.29 33.11,46.89 44.7,35.3 v44.7,34.2
SOLAR
  Top 0.61: JP6.3 75.82,79.8 41.37,79.8 MCP1700-33/1.3 | MCP1700-33/1.3 40.36,80.39 C7.1 | MCP1700-33/1.3 MCP1700-33.3 37.2,80.35 C9.1
SW  (via drill 0.35)
  Top 0.305: v42,34.2 42,32.8 57.2,17.6 v57.2,17.5
  Bottom 0.305: U1.12 22.3,59.4 22.5,59.6 26,59.6 31.9,53.7 31.9,46.3 41.8,36.4 41.8,34.4 v42,34.2 | v57.2,17.5 86.16,17.5 JP4.7
TXD  (via drill 0.35)
  Top 0.508: v12.2,39.1 22,29.3 22,15 24,13 v28,13
  Bottom 0.508: U1.35 12.14,39.16 v12.2,39.1 | v28,13 27,14 27,16
  Bottom 0.61: R9.2 24.34,16 27,16 28.02,17.02 JP1.3 36.97,17.02 LED1.C
W  (via drill 0.35)
  Top 0.305: v47.3,34.2 47.3,30.7 58.58,19.42 58.58,19.43 JP4.8
  Bottom 0.305: U1.8 17.32,58.25 17.32,59.62 19.7,62 27.2,62 34.3,54.9 34.3,47.4 47.3,34.4 v47.3,34.2
WINDSPD  (via drill 0.35)
  Top 0.305: v22.3,43 22.3,45.3 23,46 50,46 51.44,47.44 U$2.OUTPUT
  Bottom 0.305: U1.27 v22.3,43 | U$2.OUTPUT 49.06,46 46,46 44.96,47.04 R1.2

### Text on the board
tPlace: 5v | Solar | 9-24V | OUT | GND | 3V3 | WIND | RAIN | Weather Station 2.0 | T.Dreyer | Board Ver. 1.0
bPlace: SOLAR | A3 | A2 | SDA | EN | SCL | GND | 3V3 | BOOT | A1 | DHT | SDA | SCL | GND | EN | 3V3 | NW | IO0 | RX | W | RXD | SW | TXD | 3V3 | TX | S | SE | GND | E | NE | N | 3V3
201bmp: C:/Users/tfd04/Desktop/Gecko Boards.bmp